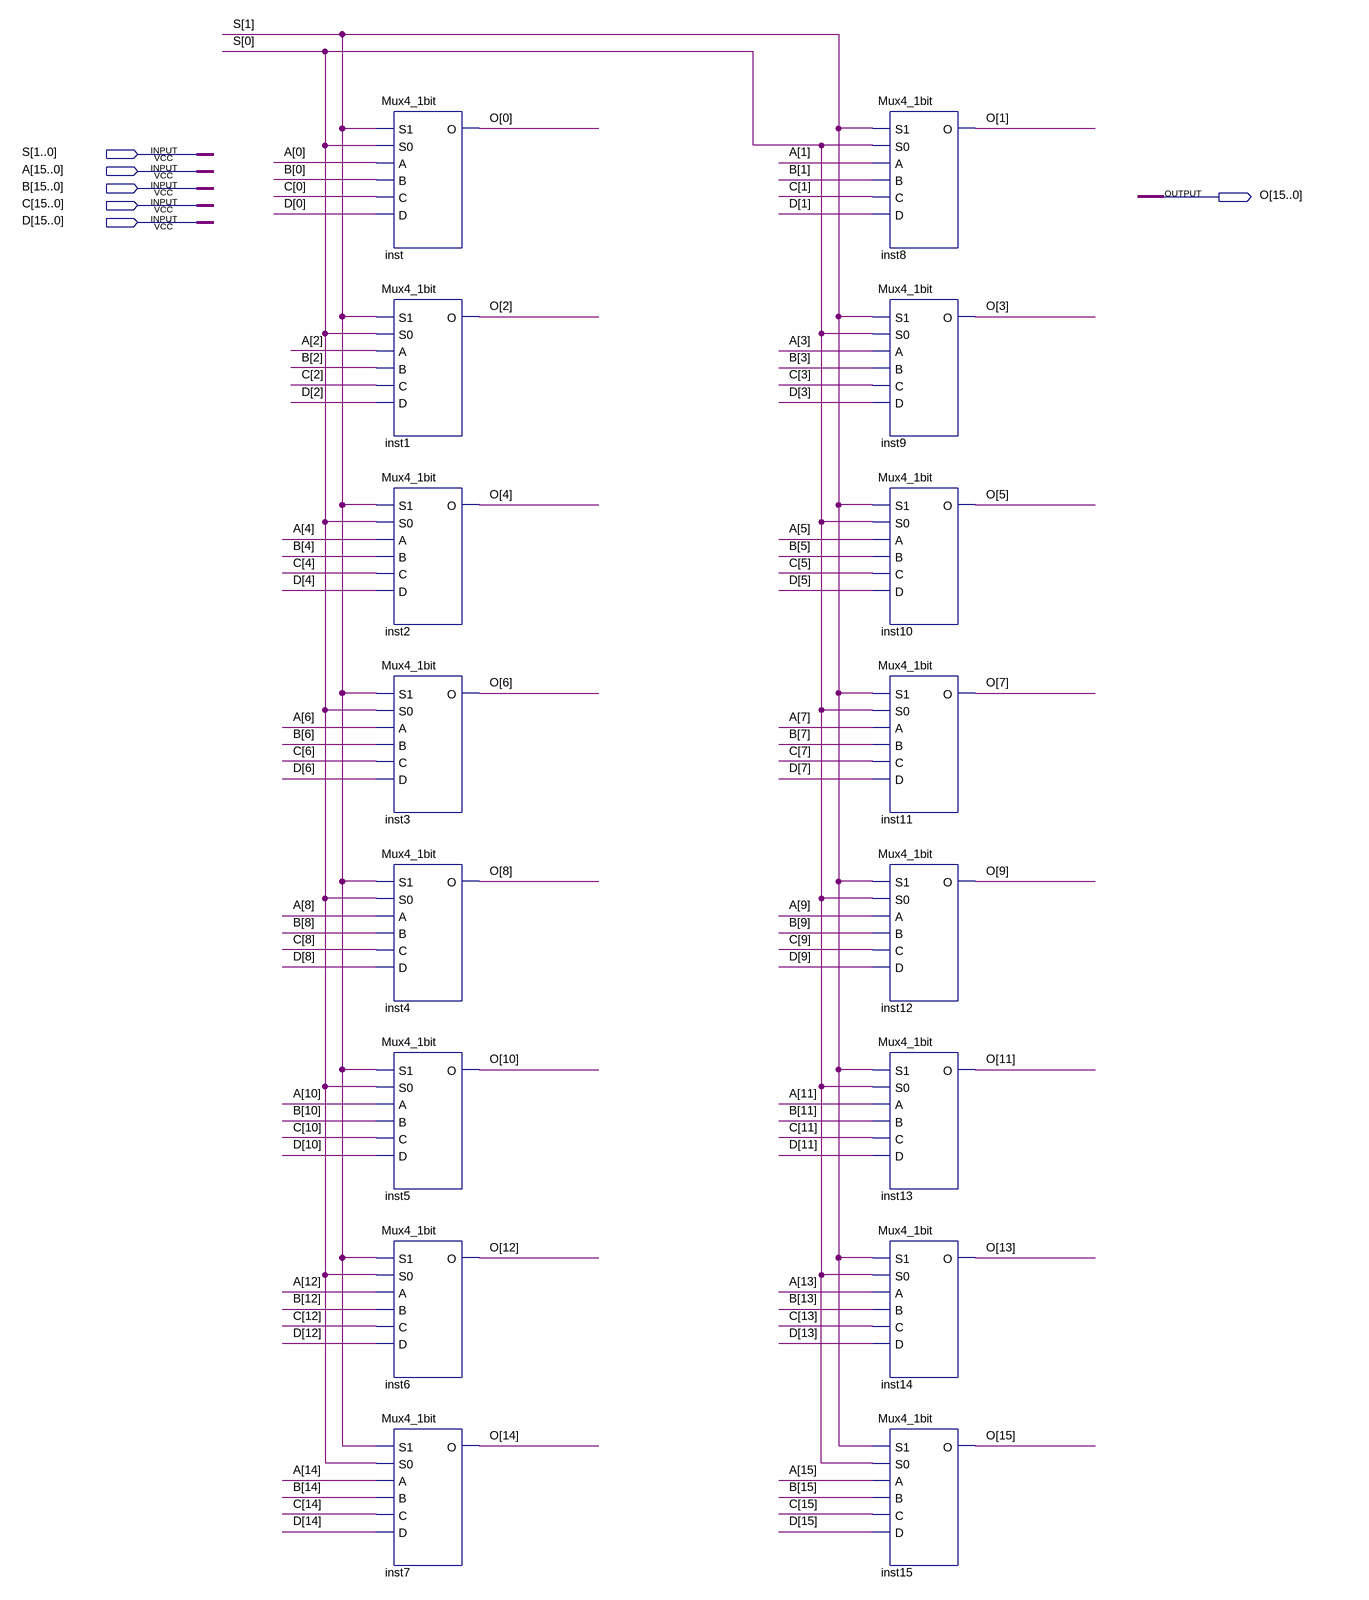
[diagram p0: schematic sheet]
// Quartus schematic Mux4to1_16bit.bdf as structural Verilog: 16 symbols, 6 pins
module Mux4to1_16bit (
  input  [1:0] S,
  input  [15:0] A,
  input  [15:0] B,
  input  [15:0] C,
  input  [15:0] D,
  output [15:0] O
);

  Mux4_1bit inst (.S1(S[1]), .S0(S[0]), .A(A[0]), .B(B[0]), .C(C[0]), .D(D[0]), .O(O[0]));
  Mux4_1bit inst1 (.S1(S[1]), .S0(S[0]), .A(A[2]), .B(B[2]), .C(C[2]), .D(D[2]), .O(O[2]));
  Mux4_1bit inst2 (.S1(S[1]), .S0(S[0]), .A(A[4]), .B(B[4]), .C(C[4]), .D(D[4]), .O(O[4]));
  Mux4_1bit inst3 (.S1(S[1]), .S0(S[0]), .A(A[6]), .B(B[6]), .C(C[6]), .D(D[6]), .O(O[6]));
  Mux4_1bit inst4 (.S1(S[1]), .S0(S[0]), .A(A[8]), .B(B[8]), .C(C[8]), .D(D[8]), .O(O[8]));
  Mux4_1bit inst5 (.S1(S[1]), .S0(S[0]), .A(A[10]), .B(B[10]), .C(C[10]), .D(D[10]), .O(O[10]));
  Mux4_1bit inst6 (.S1(S[1]), .S0(S[0]), .A(A[12]), .B(B[12]), .C(C[12]), .D(D[12]), .O(O[12]));
  Mux4_1bit inst7 (.S1(S[1]), .S0(S[0]), .A(A[14]), .B(B[14]), .C(C[14]), .D(D[14]), .O(O[14]));
  Mux4_1bit inst8 (.S1(S[1]), .S0(S[0]), .A(A[1]), .B(B[1]), .C(C[1]), .D(D[1]), .O(O[1]));
  Mux4_1bit inst9 (.S1(S[1]), .S0(S[0]), .A(A[3]), .B(B[3]), .C(C[3]), .D(D[3]), .O(O[3]));
  Mux4_1bit inst10 (.S1(S[1]), .S0(S[0]), .A(A[5]), .B(B[5]), .C(C[5]), .D(D[5]), .O(O[5]));
  Mux4_1bit inst11 (.S1(S[1]), .S0(S[0]), .A(A[7]), .B(B[7]), .C(C[7]), .D(D[7]), .O(O[7]));
  Mux4_1bit inst12 (.S1(S[1]), .S0(S[0]), .A(A[9]), .B(B[9]), .C(C[9]), .D(D[9]), .O(O[9]));
  Mux4_1bit inst13 (.S1(S[1]), .S0(S[0]), .A(A[11]), .B(B[11]), .C(C[11]), .D(D[11]), .O(O[11]));
  Mux4_1bit inst14 (.S1(S[1]), .S0(S[0]), .A(A[13]), .B(B[13]), .C(C[13]), .D(D[13]), .O(O[13]));
  Mux4_1bit inst15 (.S1(S[1]), .S0(S[0]), .A(A[15]), .B(B[15]), .C(C[15]), .D(D[15]), .O(O[15]));
endmodule
